# EAGLE design odd_v1 (EAGLE 6.3)
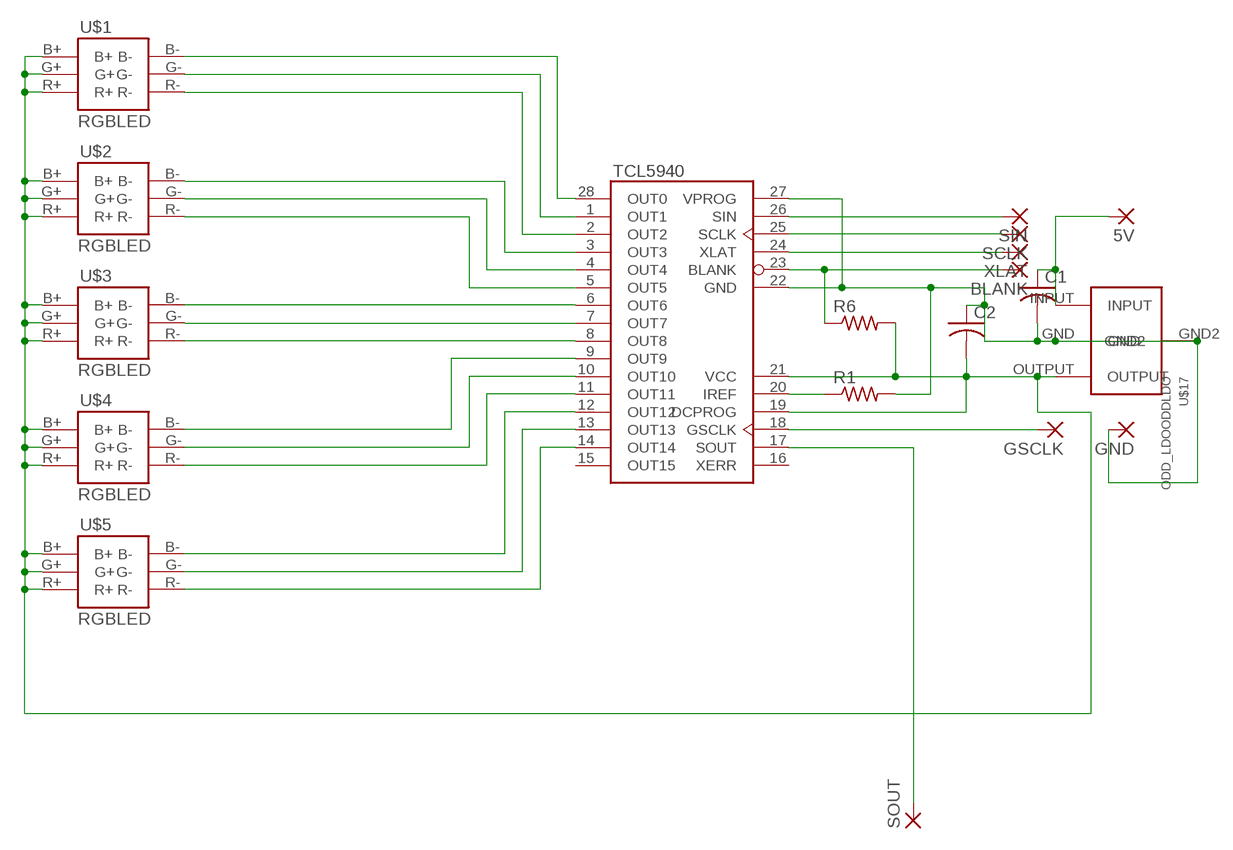
[diagram p0: schematic, sheet 1]

## Parts
5V  2,54/1,1  [2,54/1,1]
BLANK  2,54/1,1  [2,54/1,1]
C1  C-US075-032X103  [C075-032X103]
C2  C-US075-032X103  [C075-032X103]
GND  2,54/1,1  [2,54/1,1]
GSCLK  2,54/1,1  [2,54/1,1]
IC1  TCL5940  [DIP28]
R1  R-US_0204/7  [0204/7]
R6  R-US_0204/7  [0204/7]
SCLK  2,54/1,1  [2,54/1,1]
SIN  2,54/1,1  [2,54/1,1]
SOUT  2,54/1,1  [2,54/1,1]
U$1  RGBLED  CREESMDRGBLED6PADSMD  [6PADSMD]
U$2  RGBLED  CREESMDRGBLED6PADSMD  [6PADSMD]
U$3  RGBLED  CREESMDRGBLED6PADSMD  [6PADSMD]
U$4  RGBLED  CREESMDRGBLED6PADSMD  [6PADSMD]
U$5  RGBLED  CREESMDRGBLED6PADSMD  [6PADSMD]
U$17  ODD_LDOODDLDO  [4PINLDO]
XLAT  2,54/1,1  [2,54/1,1]

## Nets
N$1: IC1.28(OUT0) U$1.B-
N$2: IC1.1(OUT1) U$1.G-
N$3: IC1.2(OUT2) U$1.R-
N$4: IC1.3(OUT3) U$2.B-
N$5: IC1.4(OUT4) U$2.G-
N$6: IC1.5(OUT5) U$2.R-
N$7: IC1.6(OUT6) U$3.B-
N$8: IC1.7(OUT7) U$3.G-
N$9: IC1.8(OUT8) U$3.R-
N$11: IC1.14(OUT14) U$5.R-
N$12: IC1.13(OUT13) U$5.G-
N$13: IC1.12(OUT12) U$5.B-
N$14: IC1.11(OUT11) U$4.R-
N$15: IC1.10(OUT10) U$4.G-
N$16: IC1.9(OUT9) U$4.B-
N$17: IC1.26(SIN) SIN.1(P)
N$18: 5V.1(P) C1.1 U$17.INPUT
N$19: C1.2 C2.1 GND.1(P) IC1.22(GND) IC1.27(VPROG) R1.2 U$17.GND U$17.GND2
N$20: IC1.25(SCLK) SCLK.1(P)
N$21: IC1.24(XLAT) XLAT.1(P)
N$22: C2.2 IC1.19(DCPROG) IC1.21(VCC) R6.2 U$1.B+ U$1.G+ U$1.R+ U$2.B+ U$2.G+ U$2.R+ U$3.B+ U$3.G+ U$3.R+ U$4.B+ U$4.G+ U$4.R+ U$5.B+ U$5.G+ U$5.R+ U$17.OUTPUT
N$24: GSCLK.1(P) IC1.18(GSCLK)
N$50: IC1.17(SOUT) SOUT.1(P)
N$54: BLANK.1(P) IC1.23(BLANK) R6.1
N$58: IC1.20(IREF) R1.1
Unconnected: IC1.15(OUT15) IC1.16(XERR)

## Library data of the parts
5V BLANK GND GSCLK SCLK SIN SOUT XLAT = wirepad:2,54/1,1: THROUGH-HOLE PAD
C1 C2 = resistor:C-US: CAPACITOR, American symbol
IC1 = tcl5940:TCL5940: 16-Channel 12-Bit LED Driver
R1 R6 = resistor:R-US_: RESISTOR, American symbol
U$1-U$5 = odd_led:CREESMDRGBLED
U$17 = ODD_LDO:ODD_LDO

## Board
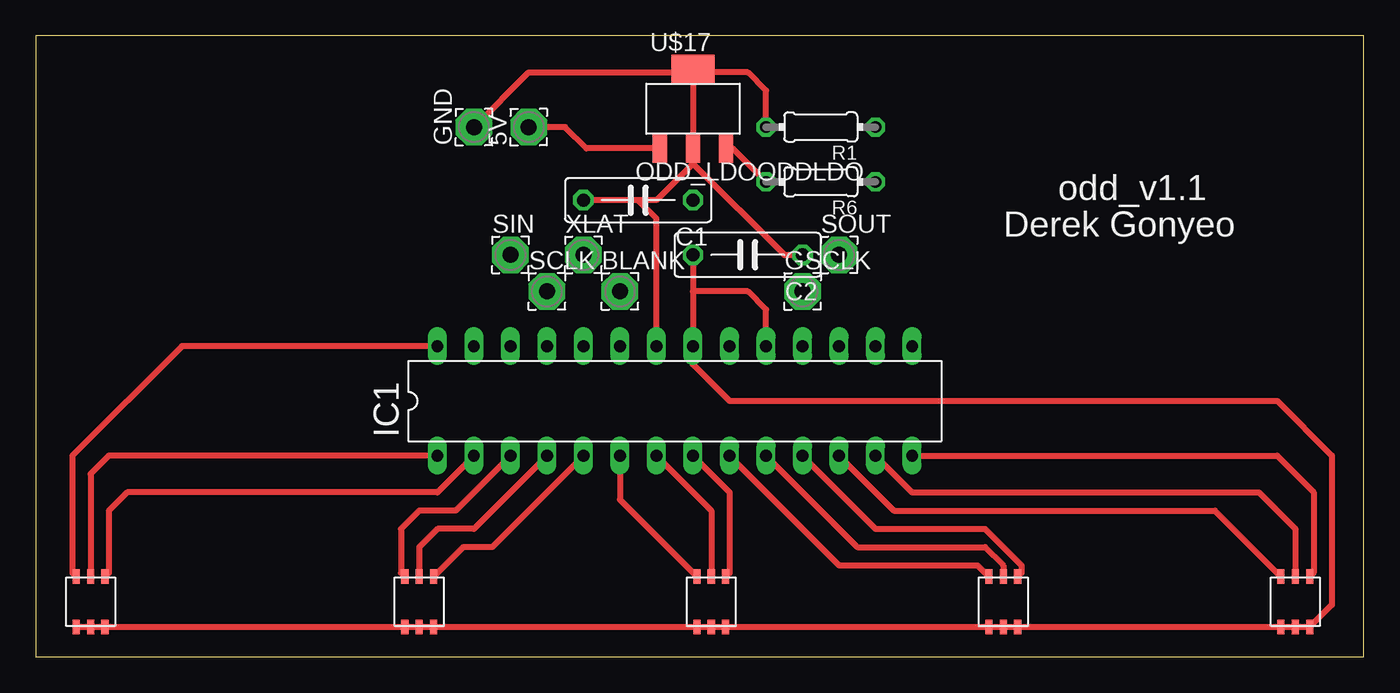
[diagram p1: board, top side]
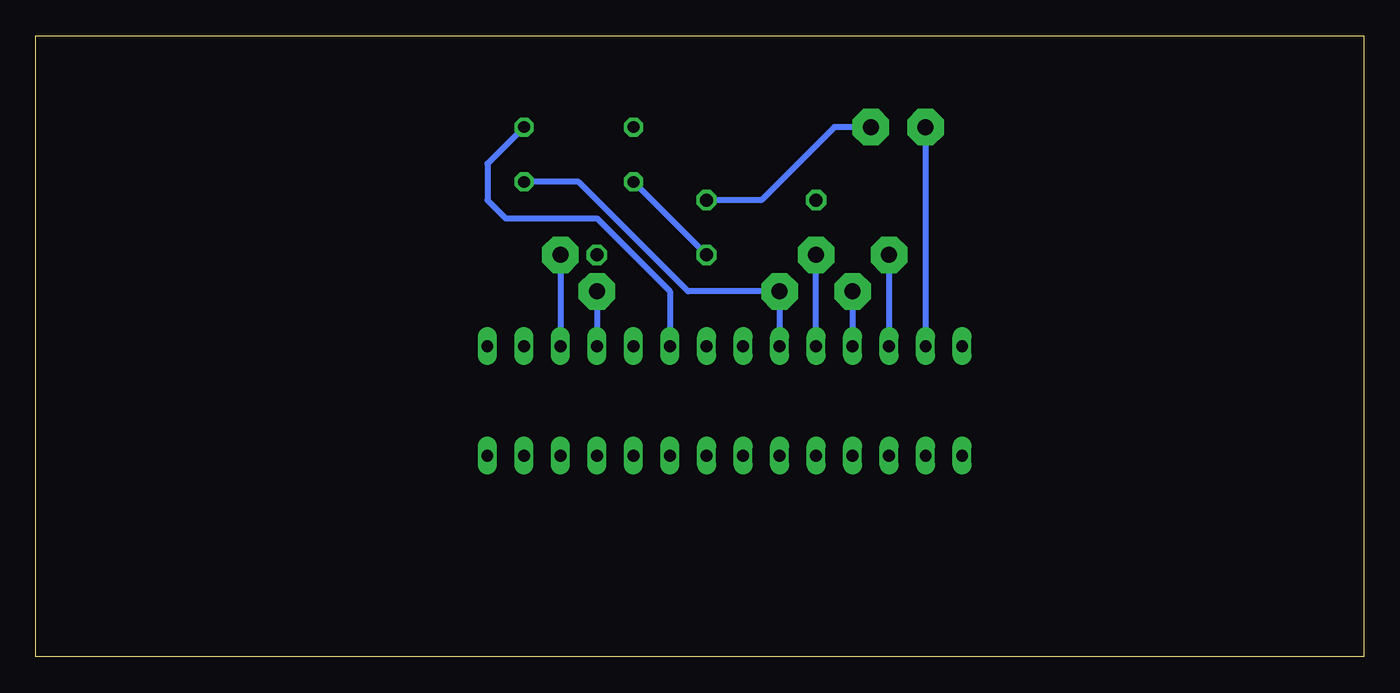
[diagram p2: board, bottom side, seen from below]

Size 92.38 x 43.17 mm. Coordinates in mm from the lower left corner, seen from the top.
Outline: 0,0 92.38,0 92.38,43.17 0,43.17 0,0
Copper layers (1*16): Top 0.035mm / dielectric 1.5mm / Bottom 0.035mm
Design rules "default": minimum track width 10mil, minimum drill 24mil, track to track 8mil, track to pad 8mil, pad to pad 8mil, via to via 8mil, smd to smd 8mil, copper to edge 40mil, drill to drill 8mil, minimum pad ring 10mil, minimum via ring 8mil, stop-mask expansion 4mil, vias tented up to drill 0mil, thermal gap 10mil

### Footprints (pad centres in the part's own frame; a part is rotated, then mirrored left to right if it is on the bottom)
2,54/1,1 = drill 1.118 pad 2.54 octagon: 1 0,0
C075-032X103 = drill 0.914 octagon: 1 -3.81,0; 2 3.81,0
DIP28 = drill 0.813 long: 1 -15.24,-3.81; 2 -12.7,-3.81; 3 -10.16,-3.81; 4 -7.62,-3.81; 5 -5.08,-3.81; 6 -2.54,-3.81; 7 0,-3.81; 8 2.54,-3.81; 9 5.08,-3.81; 10 7.62,-3.81; 11 10.16,-3.81; 12 12.7,-3.81; 13 15.24,-3.81; 14 17.78,-3.81; 15 17.78,3.81; 16 15.24,3.81; 17 12.7,3.81; 18 10.16,3.81; 19 7.62,3.81; 20 5.08,3.81; 21 2.54,3.81; 22 0,3.81; 23 -2.54,3.81; 24 -5.08,3.81; 25 -7.62,3.81; 26 -10.16,3.81; 27 -12.7,3.81; 28 -15.24,3.81
0204/7 = drill 0.813 octagon: 1 -3.81,0; 2 3.81,0
6PADSMD = smd 1 x 0.5: B+ -1.75,1; B- 1.75,1; G+ -1.75,0; G- 1.75,0; R+ -1.75,-1; R- 1.75,-1
4PINLDO = smd 1 x 2: GND 0,-2.75; INPUT -2.3,-2.75; OUTPUT 2.3,-2.75 | smd 3 x 2: GND2 0,2.75

### Placement (x,y rotation side)
5V  34.29,36.83 90 top
BLANK  40.64,25.4 0 top
C1  41.91,31.75 180 top
C2  49.53,27.94 180 top
GND  30.48,36.83 90 top
GSCLK  53.34,25.4 0 top
IC1  43.18,17.78 0 top
R1  54.61,36.83 180 top
R6  54.61,33.02 180 top
SCLK  35.56,25.4 0 top
SIN  33.02,27.94 0 top
SOUT  55.88,27.94 0 top
U$1  3.81,3.81 90 top
U$2  26.67,3.81 90 top
U$3  46.99,3.81 90 top
U$4  67.31,3.81 90 top
U$5  87.63,3.81 90 top
U$17  45.72,38.1 0 top
XLAT  38.1,27.94 0 top

### Tracks (layer width: path | path; a pad name or v marks a point on that pad's centre or on a via)
N$1
  Top 0.406: IC1.28 10.16,21.59 2.54,13.97 2.54,5.83 U$1.B-
N$2
  Top 0.406: IC1.1 5.08,13.97 3.81,12.7 U$1.G-
N$3
  Top 0.406: IC1.2 27.94,11.43 6.35,11.43 5.08,10.16 5.08,5.83 U$1.R-
N$4
  Top 0.406: IC1.3 29.21,10.16 26.67,10.16 25.4,8.89 25.4,5.83 U$2.B-
N$5
  Top 0.406: IC1.4 30.48,8.89 27.94,8.89 26.67,7.62 U$2.G-
N$6
  Top 0.406: IC1.5 31.75,7.62 29.73,7.62 U$2.R-
N$7
  Top 0.406: IC1.6 40.64,10.91 U$3.B-
N$8
  Top 0.406: IC1.7 46.99,10.16 U$3.G-
N$9
  Top 0.406: IC1.8 48.26,11.43 48.26,5.83 U$3.R-
N$11
  Top 0.406: IC1.14 86.36,13.97 88.9,11.43 88.9,5.83 U$5.R-
N$12
  Top 0.406: IC1.13 60.96,11.43 85.09,11.43 87.63,8.89 U$5.G-
N$13
  Top 0.406: IC1.12 59.69,10.16 82.03,10.16 U$5.B-
N$14
  Top 0.406: IC1.11 58.42,8.89 66.04,8.89 68.58,6.35 68.58,5.83 U$4.R-
N$15
  Top 0.406: IC1.10 57.15,7.62 66.04,7.62 67.31,6.35 U$4.G-
N$16
  Top 0.406: IC1.9 55.88,6.35 65.52,6.35 U$4.B-
N$17
  Bottom 0.406: SIN.1 IC1.26
N$18
  Top 0.406: U$17.INPUT 38.31,35.35 36.83,36.83 5V.1
  Bottom 0.406: 5V.1 36.83,36.83 41.91,31.75 C1.1
N$19
  Top 0.406: 45.72,40.64 U$17.GND 45.72,34.29 | 45.72,34.29 43.18,31.75 41.91,31.75 | 41.91,31.75 C1.2 | 45.72,34.29 52.07,27.94 C2.1 | GND.1 34.29,40.64 45.51,40.64 U$17.GND2 45.72,40.64 | R1.2 50.8,39.37 49.53,40.64 45.72,40.64 | IC1.22 43.18,30.48 41.91,31.75
  Bottom 0.406: GND.1 IC1.27
N$20
  Bottom 0.406: SCLK.1 IC1.25
N$21
  Bottom 0.406: IC1.24 XLAT.1
N$22
  Top 0.406: U$1.G+ U$1.B+ U$1.R+ U$2.B+ U$2.G+ U$2.R+ U$3.B+ U$3.G+ U$3.R+ U$4.B+ U$4.G+ U$4.R+ U$5.B+ U$5.G+ U$5.R+ 90.17,3.6 90.17,13.97 86.36,17.78 48.26,17.78 45.72,20.32 IC1.21 45.72,25.4 | U$17.OUTPUT 48.47,35.35 R6.2 | C2.2 45.72,25.4 | IC1.19 50.8,24.13 49.53,25.4 45.72,25.4
  Bottom 0.406: R6.2 C2.2
N$24
  Bottom 0.406: GSCLK.1 IC1.18
N$50
  Bottom 0.406: SOUT.1 IC1.17
N$54
  Bottom 0.406: IC1.23 BLANK.1 46.99,25.4 54.61,33.02 R6.1
N$58
  Bottom 0.406: R1.1 60.96,34.29 60.96,31.75 59.69,30.48 53.34,30.48 48.26,25.4 IC1.20

### Text on the board
tNames: odd_v1.1 | Derek Gonyeo